# Altium schematic sheet [6] ADC.SchDoc
size A4
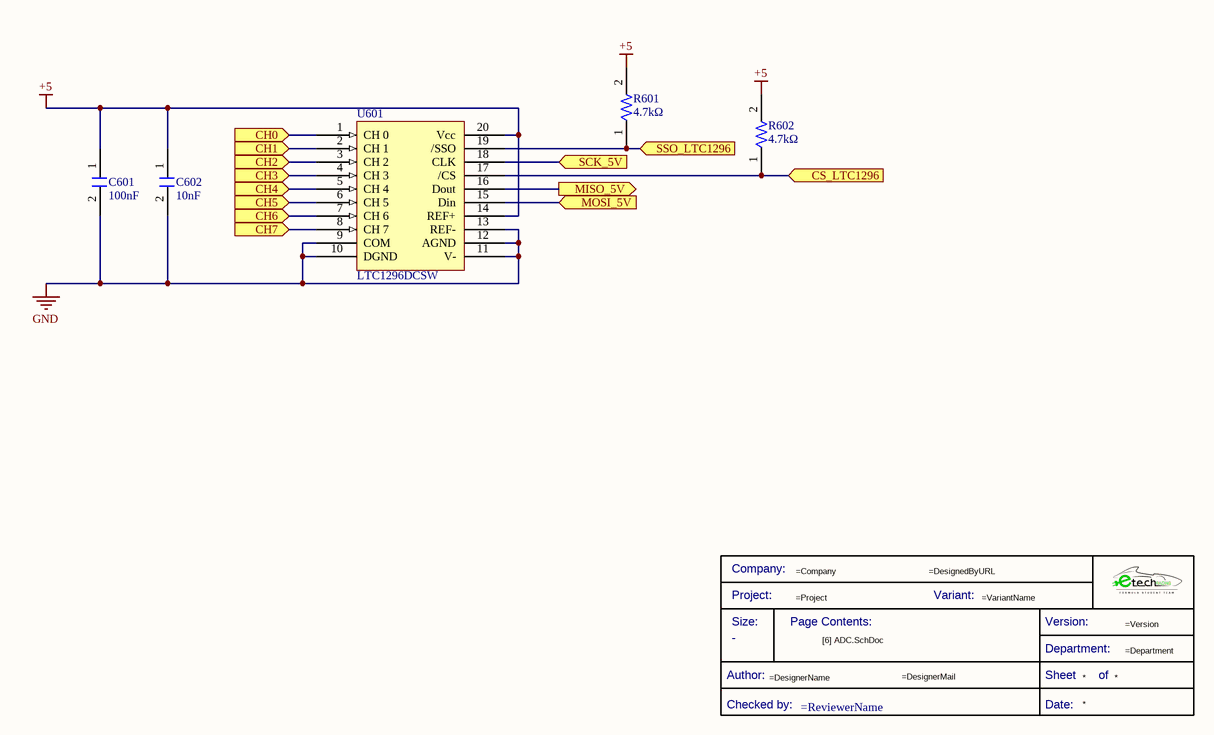
[diagram p0: [6] ADC.SchDoc]

## Parts
*  Title Block_template  (value not drawn)  (graphical)
C601  Capacitance: 100nF  [C1206FNPC-RW]  (hidden comment: 885012208009)
C602  Capacitance: 10nF  [C1206FNPC-RW]  (hidden comment: 885012208009)
R601  Resistance: 4.7kΩ  [R1206FTK-W]  (hidden comment: CRS1206-FX-4701ELF)
R602  Resistance: 4.7kΩ  [R1206FTK-W]  (hidden comment: CRS1206-FX-4701ELF)
U601  Manufacturer Part Number 1: LTC1296DCSW  [ADC_LTC1296]  (hidden comment: LTC1296)

## Ports
CH0 (in), CH1 (in), CH2 (in), CH3 (in), CH4 (in), CH5 (in), CH6 (in), CH7 (in), CS_LTC1296 (in), MISO_5V (out), MOSI_5V (in), SCK_5V (in), SSO_LTC1296 (in)

## Nets
+5: C601.1 C602.1 R601.2 R602.2 U601.14(REF+) U601.20(Vcc)
GND: C601.2 C602.2 U601.9(COM) U601.10(DGND) U601.11(V-) U601.12(AGND) U601.13(REF-)
CH0: U601.1(CH_0) ; port CH0
CH1: U601.2(CH_1) ; port CH1
CH2: U601.3(CH_2) ; port CH2
CH3: U601.4(CH_3) ; port CH3
CH4: U601.5(CH_4) ; port CH4
CH5: U601.6(CH_5) ; port CH5
CH6: U601.7(CH_6) ; port CH6
CH7: U601.8(CH_7) ; port CH7
CS_LTC1296: R602.1 U601.17(/CS) ; port CS_LTC1296
MISO_5V: U601.16(Dout) ; port MISO_5V
MOSI_5V: U601.15(Din) ; port MOSI_5V
SCK_5V: U601.18(CLK) ; port SCK_5V
SSO_LTC1296: R601.1 U601.19(/SSO) ; port SSO_LTC1296

## Notes on the sheet
- (in symbol Title Block_template) Company:; Project:; Variant:; Size:; Page Contents:; Version:; Department:; Author:; Sheet; of; Checked by:; Date:

## Library data of the parts
* = Title Block_template: Standard Title Block; .Creator: GP; Category: Title Block; .PCBcheck: GP; .SCHcheck: GP; Checked by:: =ReviewerName; Size: -
C601 C602 = C100n-10V-1206FNPC-X7R: Cap, 0.1ΜF, 10V, 10%, X7R, 1206; Manufacturer 1: Wurth Electronics; Supplier 1: Digi-Key; Manufacturer Part Number 1: 885012208009; RoHS: Yes; Category: Ceramic Capacitors; Stock 1: 7198; Pricing 1: 1=0,11000, 10=0,10300, 100=0,09200, 500=0,08100 (USD); Mount: Surface Mount; Case/Package: 1206; Case Code (Metric): 3216; Case Code (Imperial): 1206; Min Operating Temperature: -55°C; Max Operating Temperature: 125°C; Packaging: Tape and Reel; Voltage Rating: 10V; Tolerance: 10%; Length: 0.126inch; Width: 0.063inch; Thickness: 0.035inch; RoHS Compliant: Yes; ComponentLink1URL: http://www.farnell.com/datasheets/2031891.pdf?src-supplier=Farnell; ComponentLink1Description: http://www.farnell.com/datasheets/2031891.pdf?src-supplier=Farnell; ComponentLink2URL: http://katalog.we-online.de/pbs/datasheet/885012208009.pdf?src-supplier=Digi-Key; ComponentLink2Description: http://katalog.we-online.de/pbs/datasheet/885012208009.pdf?src-supplier=Digi-Key; ComponentLink3URL: https://katalog.we-online.de/pbs/datasheet/885012208009.pdf?src-supplier=Digi-Key; ComponentLink3Description: https://katalog.we-online.de/pbs/datasheet/885012208009.pdf?src-supplier=Digi-Key; Supplier Part Number 1: 732-8086-1-ND; ComponentLink4Description: Wurth Elektronik; ComponentLink4URL: https://www.we-online.com/catalog/en/WCAP-CSGP-10VDC?sq=885012208009#885012208009
R601 R602 = R4.7K-1206FTK: Res Thick Film 1206 4.7K Ohm 1% 1/2W ±100ppm/°C Molded SMD T/R; Manufacturer 1: Bourns JW Miller; Voltage Rating: 400V; Power Rating: 500mW; .Creator: AC; Supplier 1: Digi-Key; RoHS: Yes; Category: Chip SMD Resistors; Pricing 1: 1=0,42000, 10=0,35400, 100=0,13850, 1000=0,05796, 2500=0,05313 (USD); Mount: Surface Mount; Case/Package: 1206; Case Code (Metric): 3016; Case Code (Imperial): 1206; Min Operating Temperature: -55°C; Max Operating Temperature: 155°C; Packaging: Cut Tape; Resistor Type: Thick Film; Number of Terminations: 2; Termination: SMD/SMT; Working Voltage: 400V; Voltage Rating (DC): 400V; Tolerance: 1%; Max Power Dissipation: 500mW; Temperature Coefficient: 100ppm/°C; Length: 0.122inch; Width: 0.063inch; Height: 0.026inch; REACH SVHC: No SVHC; ComponentLink1URL: https://datasheet.ciiva.com/48986/70483705-48986735.pdf?src-supplier=Allied+Electronics; ComponentLink1Description: https://datasheet.ciiva.com/48986/70483705-48986735.pdf?src-supplier=Allied+Electronics; Supplier Part Number 1: CRS1206-FX-4701ELFCT-ND; ComponentLink3Description: RS; ComponentLink3URL: https://es.rs-online.com/web/p/resistencias-de-montaje-en-superficie/8672965; Manufacturer Part Number 1: CRS1206-FX-4701ELF
U601 = ADC-LTC1296: 8-Channel Single ADC SAR 46.5ksps 12-bit Serial 20-Pin SOIC W; Manufacturer 1: Analog Devices / Linear Technology; Interface: Serial,Parallel; Sampling Rate: 46500S/s; Resolution: 12b; Supply Type: Dual; Number of Bits: 12; Max Supply Voltage: 12V; Dual Supply Voltage: 5V; Number of Elements: 1; Polarity: Bipolar,Unipolar; Power Dissipation: 500mW; Integral Nonlinearity (INL): 0.75LSB; .Creator: DR; ComponentLink1Description: Datasheet; ComponentLink2Description: Where buy it; Supplier 1: Newark; RoHS: No; Category: Analog to Digital Converters (ADCs); Mount: Surface Mount; Case/Package: SOIC; Number of Pins: 20; Min Operating Temperature: 0°C; Max Operating Temperature: 70°C; Package Quantity: 38; Packaging: Rail/Tube; Operating Supply Voltage: 5V; Lead Free: Contains Lead; RoHS Compliant: No; ComponentLink3URL: https://datasheet.ciiva.com/1250/3526-1250235.pdf?src-supplier=Digi-Key; ComponentLink3Description: https://datasheet.ciiva.com/1250/3526-1250235.pdf?src-supplier=Digi-Key; Supplier Part Number 1: 56M0212